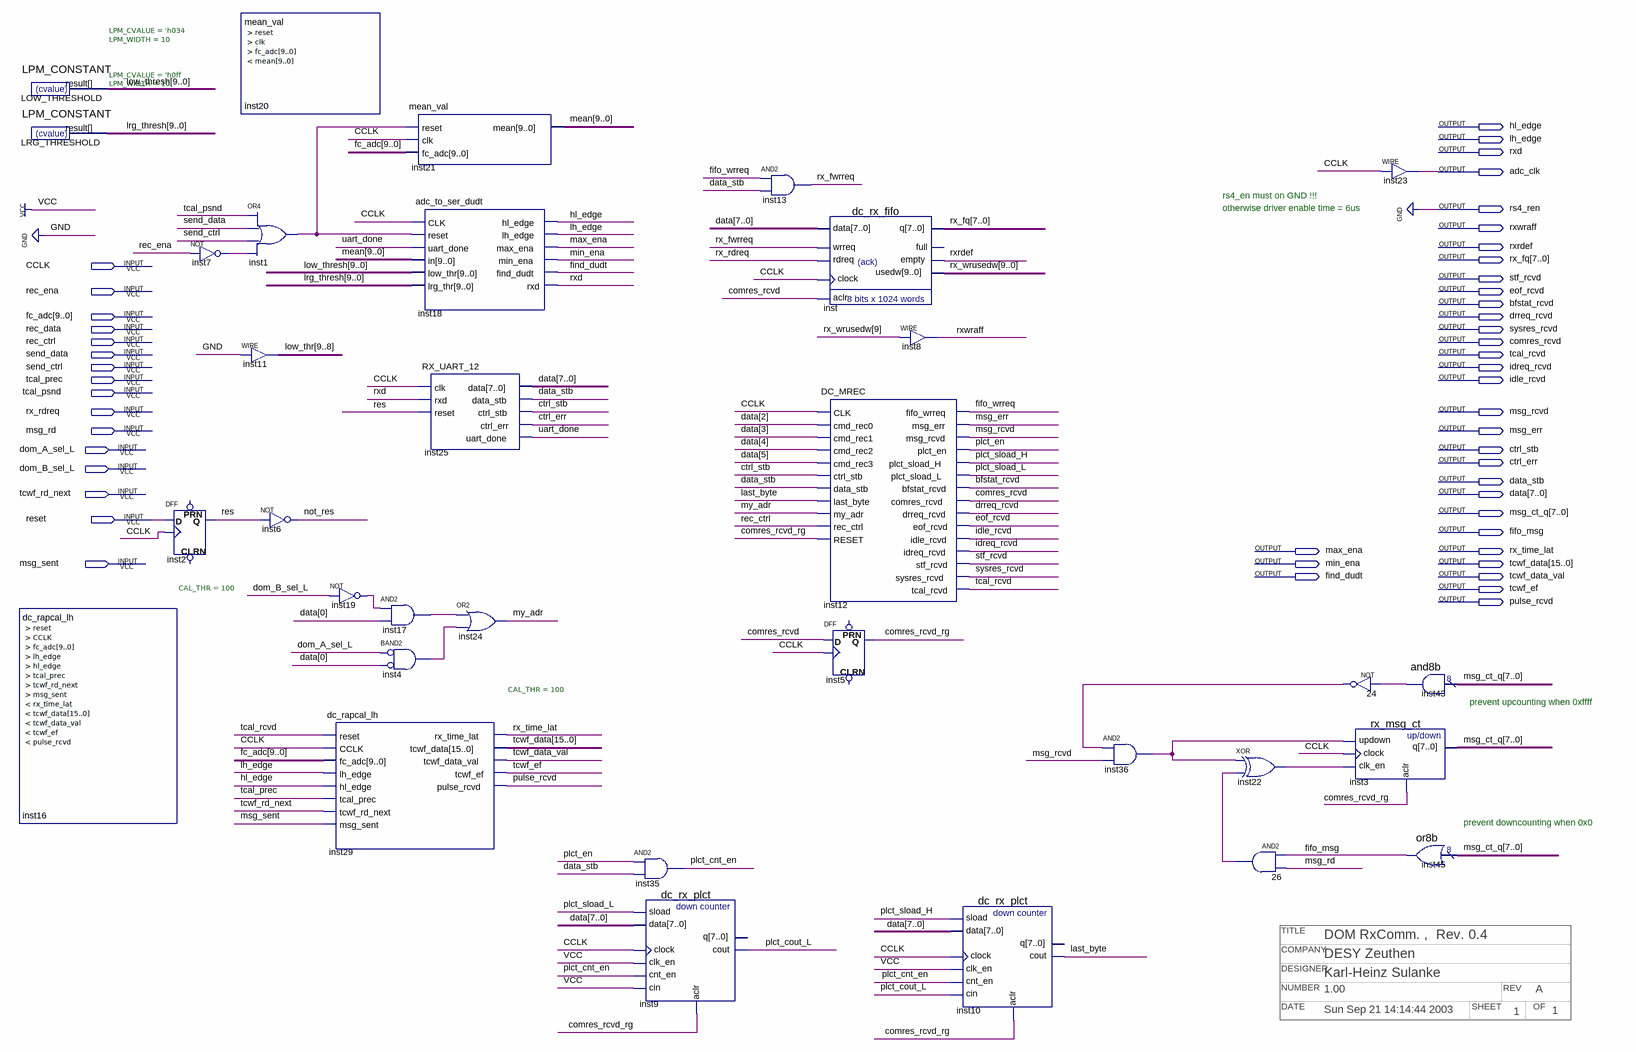
[diagram p0: schematic sheet]
// Quartus schematic DC_Rx_chan_04.bdf as structural Verilog: 33 symbols, 49 pins
// Title block: TITLE: DOM RxComm. ,  Rev. 0.4; COMPANY: DESY Zeuthen; DESIGNER: Karl-Heinz Sulanke; NUMBER: 1.00; REV: A; DATE: Sun Sep 21 14:14:44 2003; SHEET: 1; OF: 1
module DC_Rx_chan_04 (
  input  CCLK,
  input  rec_ena,
  input  [9:0] fc_adc,
  input  rec_data,
  input  rec_ctrl,
  input  send_data,
  input  send_ctrl,
  input  tcal_prec,
  input  tcal_psnd,
  input  rx_rdreq,
  input  msg_rd,
  input  dom_A_sel_L,
  input  dom_B_sel_L,
  input  tcwf_rd_next,
  input  reset,
  input  msg_sent,
  output hl_edge,
  output lh_edge,
  output rxd,
  output adc_clk,
  output rs4_ren,
  output rxwraff,
  output rxrdef,
  output [7:0] rx_fq,
  output stf_rcvd,
  output eof_rcvd,
  output bfstat_rcvd,
  output drreq_rcvd,
  output sysres_rcvd,
  output comres_rcvd,
  output tcal_rcvd,
  output idreq_rcvd,
  output idle_rcvd,
  output msg_rcvd,
  output msg_err,
  output ctrl_stb,
  output ctrl_err,
  output data_stb,
  output [7:0] data,
  output [7:0] msg_ct_q,
  output fifo_msg,
  output max_ena,
  output rx_time_lat,
  output min_ena,
  output [15:0] tcwf_data,
  output find_dudt,
  output tcwf_data_val,
  output tcwf_ef,
  output pulse_rcvd
);

  wire comres_rcvd_rg, fifo_wrreq, inst1_out, inst4_out, inst7_out, inst17_out, inst19_out, inst22_out,
       inst36_out, inst43_result, last_byte, my_adr, n24_out, n26_out, not_res, plct_cnt_en, plct_cout_L,
       plct_en, plct_sload_H, plct_sload_L, res, rx_fwrreq, uart_done;
  wire [9:0] low_thresh, lrg_thresh, mean, rx_wrusedw;
  wire [9:8] low_thr;

  LPM_CONSTANT #(.LPM_CVALUE('h034), .LPM_WIDTH(10)) LOW_THRESHOLD (.result(low_thresh));
  LPM_CONSTANT #(.LPM_CVALUE('h0ff), .LPM_WIDTH(10)) LRG_THRESHOLD (.result(lrg_thresh));
  dc_rapcal_lh #(.CAL_THR(100)) inst16 ();  // open: reset, CCLK, fc_adc, lh_edge, hl_edge, tcal_prec, tcwf_rd_next, msg_sent, rx_time_lat, tcwf_data, tcwf_data_val, tcwf_ef, pulse_rcvd
  not inst7 (inst7_out, rec_ena);
  DFF inst2 (.CLK(CCLK), .D(reset), .Q(res));  // open: CLRN, PRN
  mean_val inst20 ();  // open: reset, clk, fc_adc, mean
  or inst1 (inst1_out, tcal_psnd, send_data, send_ctrl, inst7_out);
  assign low_thr = 2'b00;  // WIRE inst11
  not inst6 (not_res, res);
  not inst19 (inst19_out, dom_B_sel_L);
  dc_rapcal_lh #(.CAL_THR(100)) inst29 (
    .reset(tcal_rcvd), .CCLK(CCLK), .fc_adc(fc_adc), .lh_edge(lh_edge), .hl_edge(hl_edge),
    .tcal_prec(tcal_prec), .tcwf_rd_next(tcwf_rd_next), .msg_sent(msg_sent), .rx_time_lat(rx_time_lat),
    .tcwf_data(tcwf_data), .tcwf_data_val(tcwf_data_val), .tcwf_ef(tcwf_ef), .pulse_rcvd(pulse_rcvd));
  mean_val inst21 (.reset(inst1_out), .clk(CCLK), .fc_adc(fc_adc), .mean(mean));
  adc_to_ser_dudt inst18 (
    .CLK(CCLK), .reset(inst1_out), .uart_done(uart_done), .in(mean), .low_thr(low_thresh),
    .lrg_thr(lrg_thresh), .hl_edge(hl_edge), .lh_edge(lh_edge), .max_ena(max_ena), .min_ena(min_ena),
    .find_dudt(find_dudt), .rxd(rxd));
  and inst17 (inst17_out, inst19_out, data[0]);
  and inst4 (inst4_out, ~dom_A_sel_L, ~data[0]);  // BAND2
  RX_UART_12 inst25 (
    .clk(CCLK), .rxd(rxd), .reset(res), .data(data), .data_stb(data_stb), .ctrl_stb(ctrl_stb),
    .ctrl_err(ctrl_err), .uart_done(uart_done));
  or inst24 (my_adr, inst17_out, inst4_out);
  and inst35 (plct_cnt_en, plct_en, data_stb);
  dc_rx_plct inst9 (
    .sload(plct_sload_L), .data(data), .clock(CCLK), .clk_en(1'b1), .cnt_en(plct_cnt_en), .cin(1'b1),
    .aclr(comres_rcvd_rg), .cout(plct_cout_L));  // open: q
  and inst13 (rx_fwrreq, fifo_wrreq, data_stb);
  dc_rx_fifo inst (
    .data(data), .wrreq(rx_fwrreq), .rdreq(rx_rdreq), .clock(CCLK), .aclr(comres_rcvd), .q(rx_fq),
    .empty(rxrdef), .usedw(rx_wrusedw));  // open: full
  DC_MREC inst12 (
    .CLK(CCLK), .cmd_rec0(data[2]), .cmd_rec1(data[3]), .cmd_rec2(data[4]), .cmd_rec3(data[5]),
    .ctrl_stb(ctrl_stb), .data_stb(data_stb), .last_byte(last_byte), .my_adr(my_adr), .rec_ctrl(rec_ctrl),
    .RESET(comres_rcvd_rg), .fifo_wrreq(fifo_wrreq), .msg_err(msg_err), .msg_rcvd(msg_rcvd),
    .plct_en(plct_en), .plct_sload_H(plct_sload_H), .plct_sload_L(plct_sload_L), .bfstat_rcvd(bfstat_rcvd),
    .comres_rcvd(comres_rcvd), .drreq_rcvd(drreq_rcvd), .eof_rcvd(eof_rcvd), .idle_rcvd(idle_rcvd),
    .idreq_rcvd(idreq_rcvd), .stf_rcvd(stf_rcvd), .sysres_rcvd(sysres_rcvd), .tcal_rcvd(tcal_rcvd));
  DFF inst5 (.CLK(CCLK), .D(comres_rcvd), .Q(comres_rcvd_rg));  // open: CLRN, PRN
  assign rxwraff = rx_wrusedw[9];  // WIRE inst8
  dc_rx_plct inst10 (
    .sload(plct_sload_H), .data(data), .clock(CCLK), .clk_en(1'b1), .cnt_en(plct_cnt_en), .cin(plct_cout_L),
    .aclr(comres_rcvd_rg), .cout(last_byte));  // open: q
  and inst36 (inst36_out, n24_out, msg_rcvd);
  xor inst22 (inst22_out, inst36_out, n26_out);
  and u_26 (n26_out, fifo_msg, msg_rd);
  not u_24 (n24_out, inst43_result);
  rx_msg_ct inst3 (.updown(inst36_out), .clock(CCLK), .clk_en(inst22_out), .aclr(comres_rcvd_rg), .q(msg_ct_q));
  assign adc_clk = CCLK;  // WIRE inst23
  and8b inst43 (.data(msg_ct_q), .result(inst43_result));
  or8b inst45 (.data(msg_ct_q), .result(fifo_msg));

  assign rs4_ren = 1'b0;

  // Notes on the sheet:
  //   rs4_en must on GND !!!
  //   otherwise driver enable time = 6us
  //   prevent upcounting when 0xffff
  //   prevent downcounting when 0x0
endmodule
